# Altium schematic sheet SH09 - OMAP-L137 EMIF B.SchDoc
size 386 x 246 mm
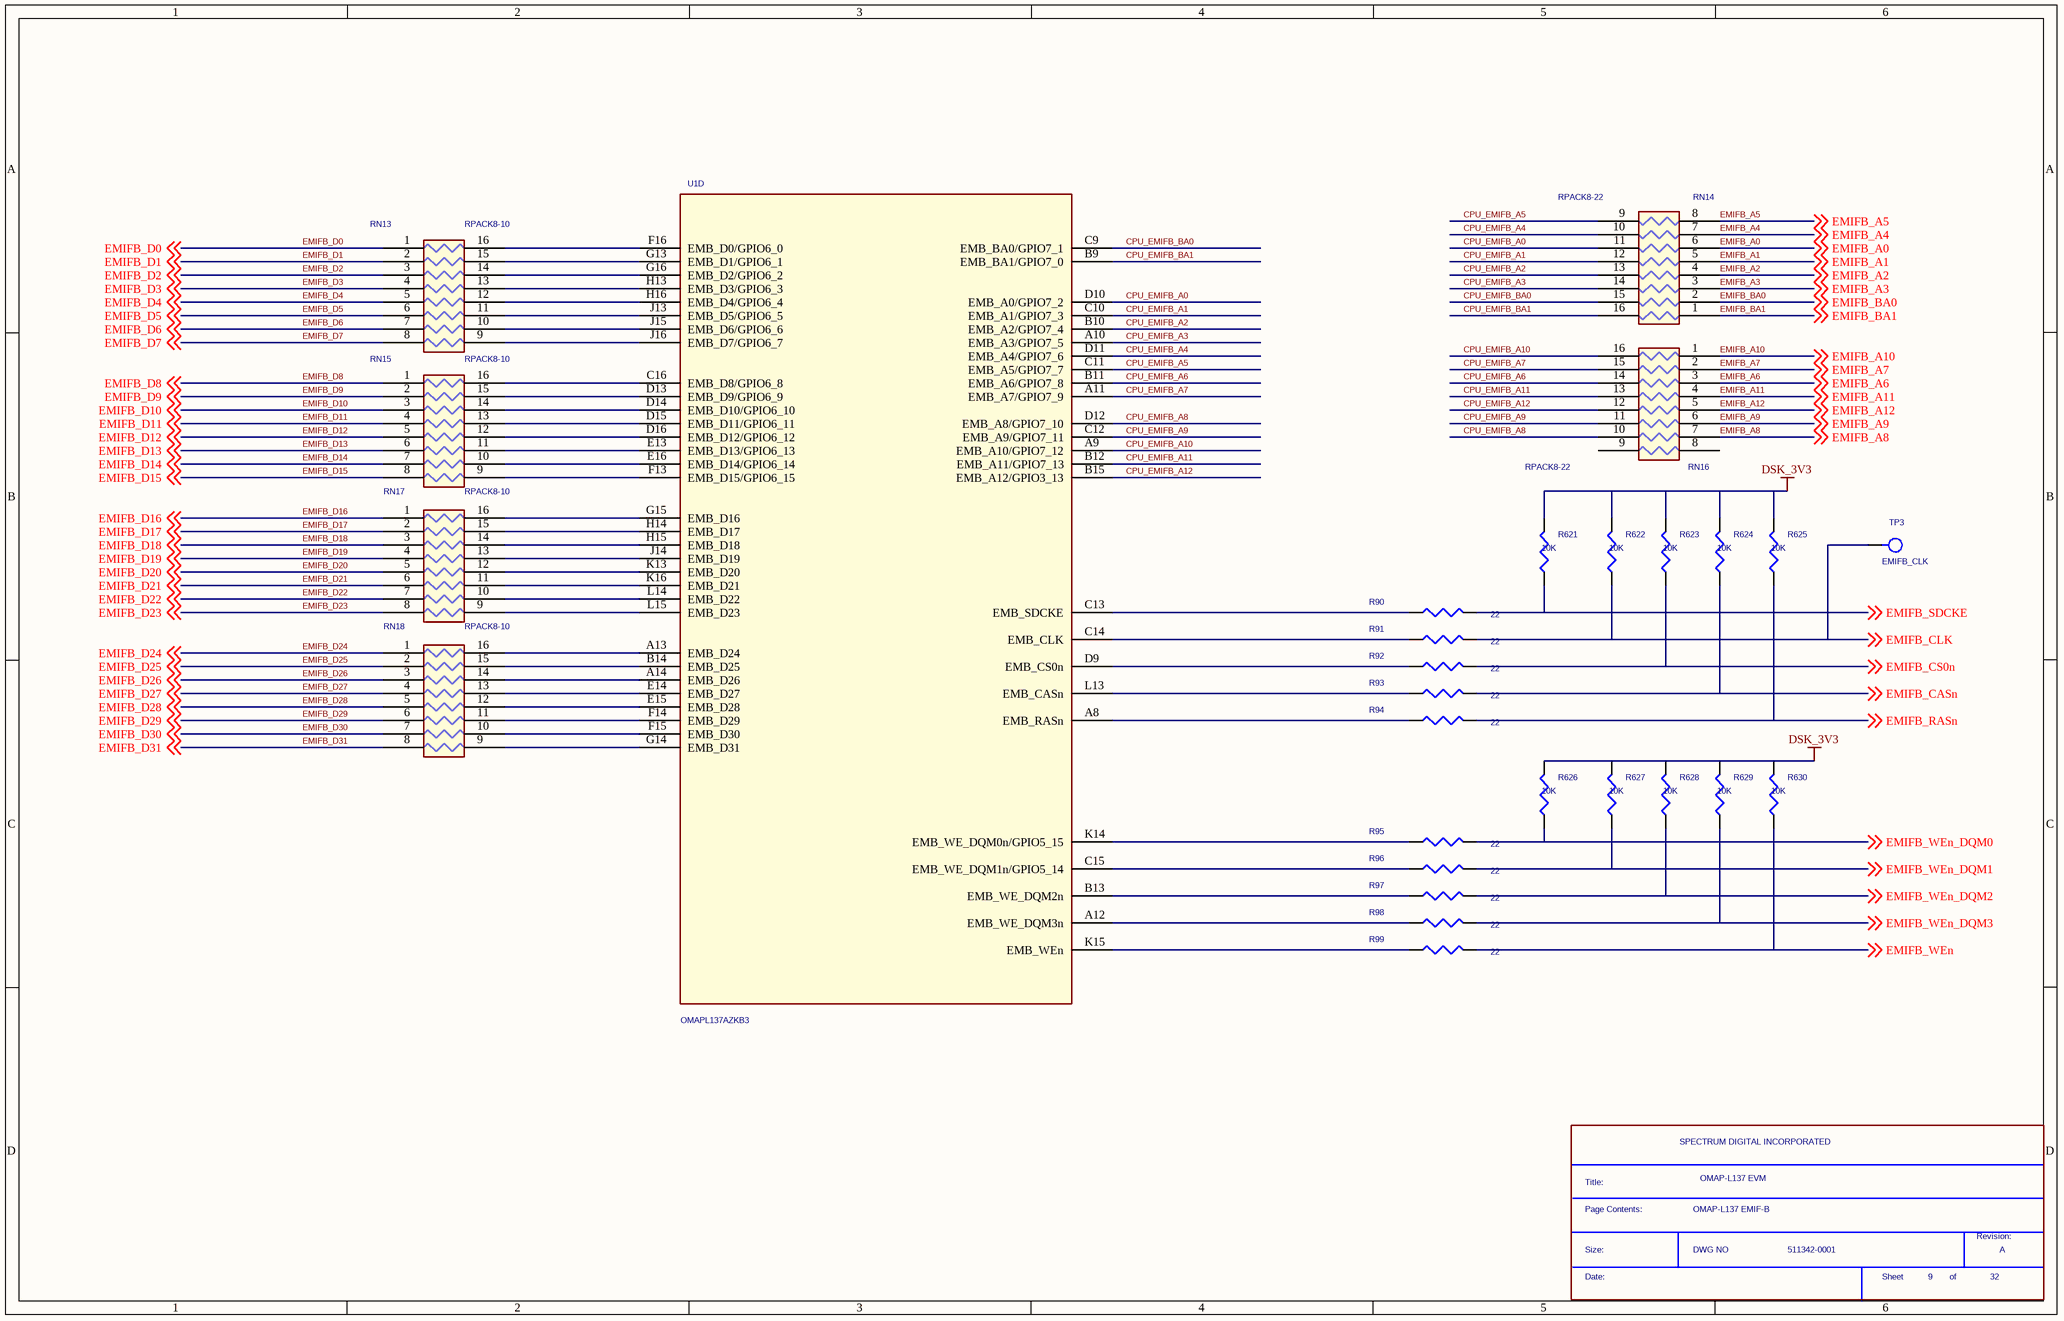
[diagram p0: SH09 - OMAP-L137 EMIF B.SchDoc]

## Parts
*  Page Contents:: OMAP-L137 EMIF-B  RevCode: A  Title: OMAP-L137 EVM  OrgName: SPECTRUM DIGITAL INCORPORATED  Doc: 511342-0001  Page Number: 9  Page Count: 32  (hidden comment: SDTitleBlock)  (graphical)
R90  22  [r402-25]
R91  22  [r402-25]
R92  22  [r402-25]
R93  22  [r402-25]
R94  22  [r402-25]
R95  22  [r402-25]
R96  22  [r402-25]
R97  22  [r402-25]
R98  22  [r402-25]
R99  22  [r402-25]
R621  10K  [r402-25]
R622  10K  [r402-25]
R623  10K  [r402-25]
R624  10K  [r402-25]
R625  10K  [r402-25]
R626  10K  [r402-25]
R627  10K  [r402-25]
R628  10K  [r402-25]
R629  10K  [r402-25]
R630  10K  [r402-25]
RN13  RPACK8-10  [rpak16-10x25-2hv]
RN14  RPACK8-22  [rpak16-10x25-2hv]
RN15  RPACK8-10  [rpak16-10x25-2hv]
RN16  RPACK8-22  [rpak16-10x25-2hv]
RN17  RPACK8-10  [rpak16-10x25-2hv]
RN18  RPACK8-10  [rpak16-10x25-2hv]
TP3  EMIFB_CLK  [tp1-6040]
U1  OMAPL137AZKB3  [skt256-6064]  (part D of 9)

## Nets
DSK_3V3: R621.1 R622.1 R623.1 R624.1 R625.1 R626.1 R627.1 R628.1 R629.1 R630.1
CPU_EMIFB_A0: RN14.11 U1.D10(EMB_A0/GPIO7_2)
CPU_EMIFB_A1: RN14.12 U1.C10(EMB_A1/GPIO7_3)
CPU_EMIFB_A2: RN14.13 U1.B10(EMB_A2/GPIO7_4)
CPU_EMIFB_A3: RN14.14 U1.A10(EMB_A3/GPIO7_5)
CPU_EMIFB_A4: RN14.10 U1.D11(EMB_A4/GPIO7_6)
CPU_EMIFB_A5: RN14.9 U1.C11(EMB_A5/GPIO7_7)
CPU_EMIFB_A6: RN16.14 U1.B11(EMB_A6/GPIO7_8)
CPU_EMIFB_A7: RN16.15 U1.A11(EMB_A7/GPIO7_9)
CPU_EMIFB_A8: RN16.10 U1.D12(EMB_A8/GPIO7_10)
CPU_EMIFB_A9: RN16.11 U1.C12(EMB_A9/GPIO7_11)
CPU_EMIFB_A10: RN16.16 U1.A9(EMB_A10/GPIO7_12)
CPU_EMIFB_A11: RN16.13 U1.B12(EMB_A11/GPIO7_13)
CPU_EMIFB_A12: RN16.12 U1.B15(EMB_A12/GPIO3_13)
CPU_EMIFB_BA0: RN14.15 U1.C9(EMB_BA0/GPIO7_1)
CPU_EMIFB_BA1: RN14.16 U1.B9(EMB_BA1/GPIO7_0)
EMIFB_A0: RN14.6 ; off-sheet EMIFB_A0
EMIFB_A1: RN14.5 ; off-sheet EMIFB_A1
EMIFB_A2: RN14.4 ; off-sheet EMIFB_A2
EMIFB_A3: RN14.3 ; off-sheet EMIFB_A3
EMIFB_A4: RN14.7 ; off-sheet EMIFB_A4
EMIFB_A5: RN14.8 ; off-sheet EMIFB_A5
EMIFB_A6: RN16.3 ; off-sheet EMIFB_A6
EMIFB_A7: RN16.2 ; off-sheet EMIFB_A7
EMIFB_A8: RN16.7 ; off-sheet EMIFB_A8
EMIFB_A9: RN16.6 ; off-sheet EMIFB_A9
EMIFB_A10: RN16.1 ; off-sheet EMIFB_A10
EMIFB_A11: RN16.4 ; off-sheet EMIFB_A11
EMIFB_A12: RN16.5 ; off-sheet EMIFB_A12
EMIFB_BA0: RN14.2 ; off-sheet EMIFB_BA0
EMIFB_BA1: RN14.1 ; off-sheet EMIFB_BA1
EMIFB_CASn: R93.1 R624.2 ; off-sheet EMIFB_CASn
EMIFB_CLK: R91.1 R622.2 TP3.1(PIN) ; off-sheet EMIFB_CLK
EMIFB_CS0n: R92.1 R623.2 ; off-sheet EMIFB_CS0n
EMIFB_D0: RN13.1 ; off-sheet EMIFB_D0
EMIFB_D1: RN13.2 ; off-sheet EMIFB_D1
EMIFB_D2: RN13.3 ; off-sheet EMIFB_D2
EMIFB_D3: RN13.4 ; off-sheet EMIFB_D3
EMIFB_D4: RN13.5 ; off-sheet EMIFB_D4
EMIFB_D5: RN13.6 ; off-sheet EMIFB_D5
EMIFB_D6: RN13.7 ; off-sheet EMIFB_D6
EMIFB_D7: RN13.8 ; off-sheet EMIFB_D7
EMIFB_D8: RN15.1 ; off-sheet EMIFB_D8
EMIFB_D9: RN15.2 ; off-sheet EMIFB_D9
EMIFB_D10: RN15.3 ; off-sheet EMIFB_D10
EMIFB_D11: RN15.4 ; off-sheet EMIFB_D11
EMIFB_D12: RN15.5 ; off-sheet EMIFB_D12
EMIFB_D13: RN15.6 ; off-sheet EMIFB_D13
EMIFB_D14: RN15.7 ; off-sheet EMIFB_D14
EMIFB_D15: RN15.8 ; off-sheet EMIFB_D15
EMIFB_D16: RN17.1 ; off-sheet EMIFB_D16
EMIFB_D17: RN17.2 ; off-sheet EMIFB_D17
EMIFB_D18: RN17.3 ; off-sheet EMIFB_D18
EMIFB_D19: RN17.4 ; off-sheet EMIFB_D19
EMIFB_D20: RN17.5 ; off-sheet EMIFB_D20
EMIFB_D21: RN17.6 ; off-sheet EMIFB_D21
EMIFB_D22: RN17.7 ; off-sheet EMIFB_D22
EMIFB_D23: RN17.8 ; off-sheet EMIFB_D23
EMIFB_D24: RN18.1 ; off-sheet EMIFB_D24
EMIFB_D25: RN18.2 ; off-sheet EMIFB_D25
EMIFB_D26: RN18.3 ; off-sheet EMIFB_D26
EMIFB_D27: RN18.4 ; off-sheet EMIFB_D27
EMIFB_D28: RN18.5 ; off-sheet EMIFB_D28
EMIFB_D29: RN18.6 ; off-sheet EMIFB_D29
EMIFB_D30: RN18.7 ; off-sheet EMIFB_D30
EMIFB_D31: RN18.8 ; off-sheet EMIFB_D31
EMIFB_RASn: R94.1 R625.2 ; off-sheet EMIFB_RASn
EMIFB_SDCKE: R90.1 R621.2 ; off-sheet EMIFB_SDCKE
EMIFB_WEn: R99.1 R630.2 ; off-sheet EMIFB_WEn
EMIFB_WEn_DQM0: R95.1 R626.2 ; off-sheet EMIFB_WEn_DQM0
EMIFB_WEn_DQM1: R96.1 R627.2 ; off-sheet EMIFB_WEn_DQM1
EMIFB_WEn_DQM2: R97.1 R628.2 ; off-sheet EMIFB_WEn_DQM2
EMIFB_WEn_DQM3: R98.1 R629.2 ; off-sheet EMIFB_WEn_DQM3
NetR90_2: R90.2 U1.C13(EMB_SDCKE)
NetR91_2: R91.2 U1.C14(EMB_CLK)
NetR92_2: R92.2 U1.D9(EMB_CS0n)
NetR93_2: R93.2 U1.L13(EMB_CASn)
NetR94_2: R94.2 U1.A8(EMB_RASn)
NetR95_2: R95.2 U1.K14(EMB_WE_DQM0n/GPIO5_15)
NetR96_2: R96.2 U1.C15(EMB_WE_DQM1n/GPIO5_14)
NetR97_2: R97.2 U1.B13(EMB_WE_DQM2n)
NetR98_2: R98.2 U1.A12(EMB_WE_DQM3n)
NetR99_2: R99.2 U1.K15(EMB_WEn)
NetRN13_9: RN13.9 U1.J16(EMB_D7/GPIO6_7)
NetRN13_10: RN13.10 U1.J15(EMB_D6/GPIO6_6)
NetRN13_11: RN13.11 U1.J13(EMB_D5/GPIO6_5)
NetRN13_12: RN13.12 U1.H16(EMB_D4/GPIO6_4)
NetRN13_13: RN13.13 U1.H13(EMB_D3/GPIO6_3)
NetRN13_14: RN13.14 U1.G16(EMB_D2/GPIO6_2)
NetRN13_15: RN13.15 U1.G13(EMB_D1/GPIO6_1)
NetRN13_16: RN13.16 U1.F16(EMB_D0/GPIO6_0)
NetRN15_9: RN15.9 U1.F13(EMB_D15/GPIO6_15)
NetRN15_10: RN15.10 U1.E16(EMB_D14/GPIO6_14)
NetRN15_11: RN15.11 U1.E13(EMB_D13/GPIO6_13)
NetRN15_12: RN15.12 U1.D16(EMB_D12/GPIO6_12)
NetRN15_13: RN15.13 U1.D15(EMB_D11/GPIO6_11)
NetRN15_14: RN15.14 U1.D14(EMB_D10/GPIO6_10)
NetRN15_15: RN15.15 U1.D13(EMB_D9/GPIO6_9)
NetRN15_16: RN15.16 U1.C16(EMB_D8/GPIO6_8)
NetRN17_9: RN17.9 U1.L15(EMB_D23)
NetRN17_10: RN17.10 U1.L14(EMB_D22)
NetRN17_11: RN17.11 U1.K16(EMB_D21)
NetRN17_12: RN17.12 U1.K13(EMB_D20)
NetRN17_13: RN17.13 U1.J14(EMB_D19)
NetRN17_14: RN17.14 U1.H15(EMB_D18)
NetRN17_15: RN17.15 U1.H14(EMB_D17)
NetRN17_16: RN17.16 U1.G15(EMB_D16)
NetRN18_9: RN18.9 U1.G14(EMB_D31)
NetRN18_10: RN18.10 U1.F15(EMB_D30)
NetRN18_11: RN18.11 U1.F14(EMB_D29)
NetRN18_12: RN18.12 U1.E15(EMB_D28)
NetRN18_13: RN18.13 U1.E14(EMB_D27)
NetRN18_14: RN18.14 U1.A14(EMB_D26)
NetRN18_15: RN18.15 U1.B14(EMB_D25)
NetRN18_16: RN18.16 U1.A13(EMB_D24)

Not connected (* = marked no-connect by the designer): RN16 8 9

## Notes on the sheet
- (in symbol SDTitleBlock) Title:; Page Contents:; Revision:; Size:; DWG NO; Date:; Sheet; of

## Library data of the parts
R90-R99 = R_0: Part #: 101370-2200R
R621-R630 = R: Part #: 101370-1003R
RN13 RN15 RN17 RN18 = RESISTOR DIP 8_0: Part #: 101069-1000R
RN14 RN16 = RESISTOR DIP 8_0: Part #: 101069-2200R
TP3 = Test Point_1: Test Point; PartName: HEADER 1; Vendor: Digi-Key; Vendor Nbr: S2111-36-ND
U1 = PRIMUS_BGA_1: Part #: 102772-0001; SWAP_INFO: (S1+S2+S3+S4+S5+S6+S7+S8+S9); SPLIT_INST: TRUE